# Altium project Infinit8I__.PrjPcb
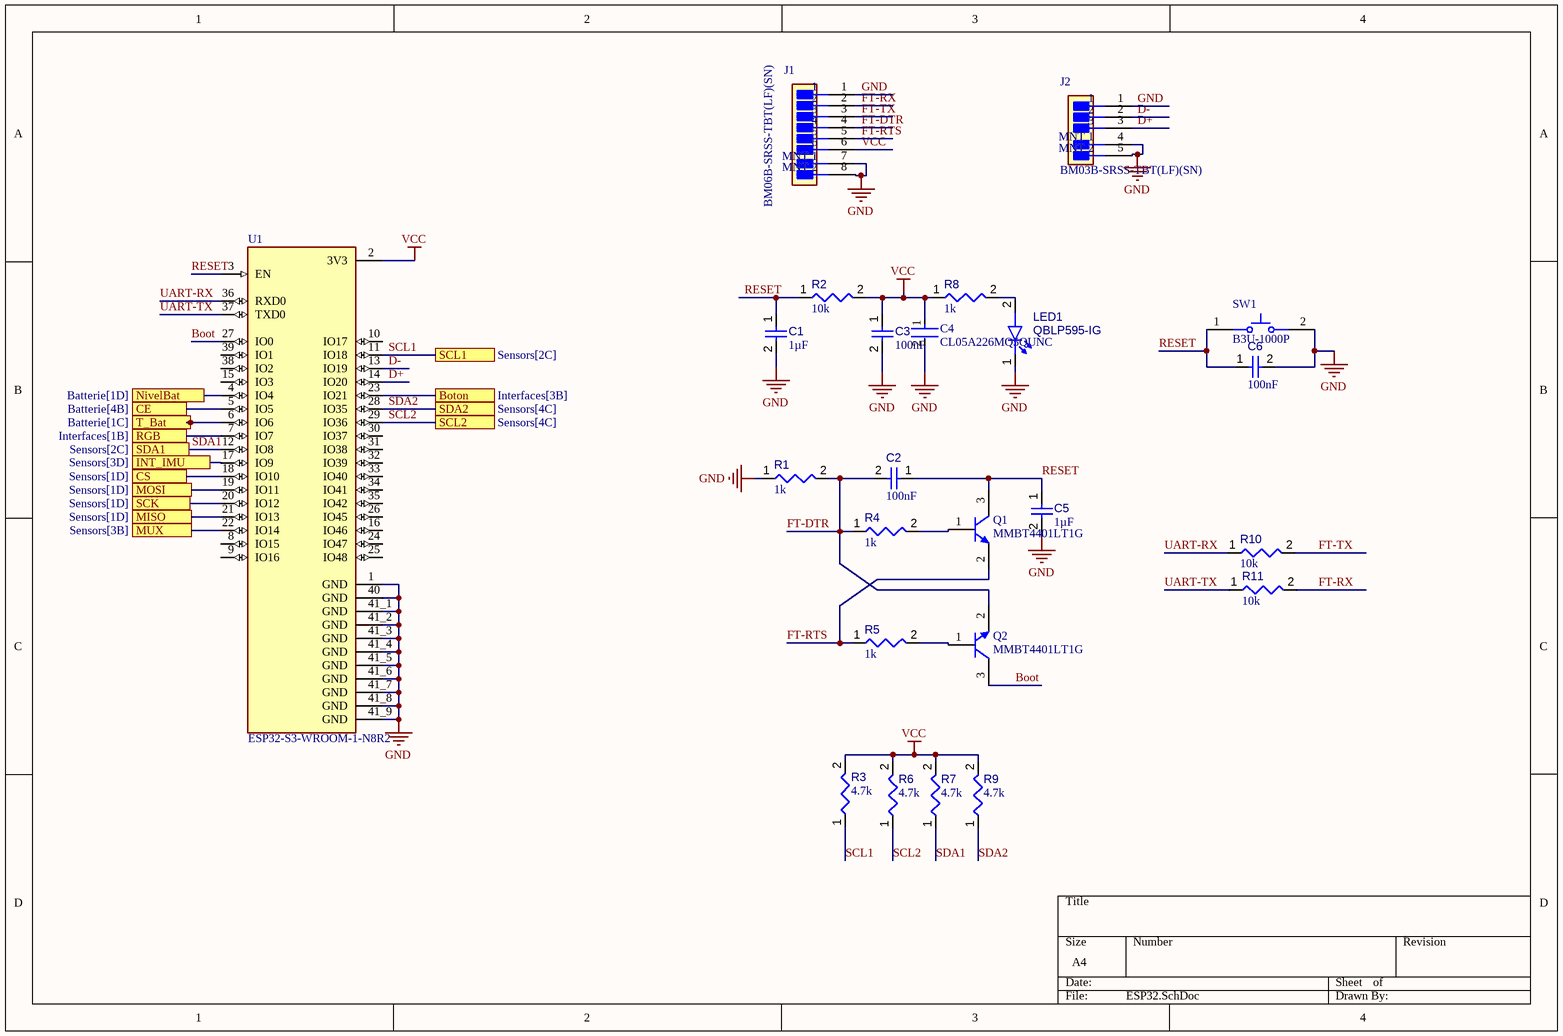
[diagram p0: ESP32.SchDoc]
4 sheets, 83 parts. Net scope: flat (ports and power ports of the same name join across sheets).
Board file: Infinit8I.PcbDoc
Sheets:
  ESP32.SchDoc
  Sensors.SchDoc
  Interfaces.SchDoc
  Batterie.SchDoc

## Sheet ESP32.SchDoc
size A4; SheetNumber: 1; SheetTotal: 4

### Parts
C1  value 1µF  [CAPC1005X55X25LL05T10]  (hidden comment: Capacitor 1 uF +/- 10% 6.3 V 0402)
C2  value 100nF  [CAPC1005X56X25LL10T15]  (hidden comment: Capacitor 0.1 uF +/- 5% 16 V 0402)
C3  value 100nF  [CAPC1005X56X25LL10T15]  (hidden comment: Capacitor 0.1 uF +/- 5% 16 V 0402)
C4  CL05A226MQ5QUNC  [FP-CL746-IPC_C]
C5  value 1µF  [CAPC1005X55X25LL05T10]  (hidden comment: Capacitor 1 uF +/- 10% 6.3 V 0402)
C6  value 100nF  [CAPC1005X56X25LL10T15]  (hidden comment: Capacitor 0.1 uF +/- 5% 16 V 0402)
J1  BM06B-SRSS-TBT(LF)(SN)  [FP-BM06B-SRSS-TBT_LF_SN-MFG]
J2  BM03B-SRSS-TBT(LF)(SN)  [FP-BM03B-SRSS-TBT_LF_SN-MFG]
LED1  QBLP595-IG  [QTB-QBLP595_V]
Q1  MMBT4401LT1G  [ONSC-SOT-23-3-318-08_V]
Q2  MMBT4401LT1G  [ONSC-SOT-23-3-318-08_V]
R1  value 1k  [RESC0402(1005)_L]  (hidden comment: Resistor 1K +/-5 % 0402 63 mW)
R2  value 10k  [RESC0402(1005)_L]  (hidden comment: Resistor 10K  +/-1 % 0402 63 mW)
R3  value 4.7k  [RESC1005X40X25ML05T05]  (hidden comment: Resistor 4k7 +/-1% 0402 100 mW)
R4  value 1k  [RESC0402(1005)_L]  (hidden comment: Resistor 1K +/-5 % 0402 63 mW)
R5  value 1k  [RESC0402(1005)_L]  (hidden comment: Resistor 1K +/-5 % 0402 63 mW)
R6  value 4.7k  [RESC1005X40X25ML05T05]  (hidden comment: Resistor 4k7 +/-1% 0402 100 mW)
R7  value 4.7k  [RESC1005X40X25ML05T05]  (hidden comment: Resistor 4k7 +/-1% 0402 100 mW)
R8  value 1k  [RESC0402(1005)_L]  (hidden comment: Resistor 1K +/-5 % 0402 63 mW)
R9  value 4.7k  [RESC1005X40X25ML05T05]  (hidden comment: Resistor 4k7 +/-1% 0402 100 mW)
R10  value 10k  [RESC0402(1005)_L]  (hidden comment: Resistor 10K  +/-1 % 0402 63 mW)
R11  value 10k  [RESC0402(1005)_L]  (hidden comment: Resistor 10K  +/-1 % 0402 63 mW)
SW1  B3U-1000P  [OMRON-B3U-1000_V]
U1  ESP32-S3-WROOM-1-N8R2  [XCVR_ESP32-S3-WROOM-1-N8R2]

### Ports
Boton (see Interfaces[3B]), CE (see Batterie[4B]), CS (see Sensors[1D]), INT_IMU (see Sensors[3D]), MISO (see Sensors[1D]), MOSI (see Sensors[1D]), MUX (see Sensors[3B]), NivelBat (see Batterie[1D]), RGB (see Interfaces[1B]), SCK (see Sensors[1D]), SCL1 (see Sensors[2C]), SCL2 (see Sensors[4C]), SDA1 (see Sensors[2C]), SDA2 (see Sensors[4C]), T_Bat (see Batterie[1C])

### Nets
GND: C1.2 C3.2 C4.2 C5.2 C6.2 J1.1 J1.7(MNT_1) J1.8(MNT_2) J2.1 J2.4(MNT_1) J2.5(MNT_2) LED1.1(K) R1.1 SW1.2 U1.1(GND) U1.40(GND) U1.41_1(GND) U1.41_2(GND) U1.41_3(GND) U1.41_4(GND) U1.41_5(GND) U1.41_6(GND) U1.41_7(GND) U1.41_8(GND) U1.41_9(GND)
VCC: C3.1 C4.1 J1.6 R2.2 R3.2 R6.2 R7.2 R8.1 R9.2 U1.2(3V3)
Boot: Q2.3(C) U1.27(IO0)
D+: J2.3 U1.14(IO20)
D-: J2.2 U1.13(IO19)
FT-DTR: C2.2 J1.4 Q2.2(E) R1.2 R4.1
FT-RTS: J1.5 Q1.2(E) R5.1
FT-RX: J1.2 R11.2
FT-TX: J1.3 R10.2
MUX: U1.22(IO14) ; port MUX
RESET: C1.1 C2.1 C5.1 C6.1 Q1.3(C) R2.1 SW1.1 U1.3(EN)
SCL1: R3.1 U1.11(IO18) ; port SCL1
SCL2: R6.1 U1.29(IO36) ; port SCL2
SDA1: R7.1 U1.12(IO8) ; port SDA1
SDA2: R9.1 U1.28(IO35) ; port SDA2
T_Bat: U1.6(IO6) ; port T_Bat
UART-RX: R10.1 U1.36(RXD0)
UART-TX: R11.1 U1.37(TXD0)
NetLED1_2: LED1.2(A) R8.2
NetQ1_1: Q1.1(B) R4.2
NetQ2_1: Q2.1(B) R5.2
NetR21_2: U1.23(IO21) ; port Boton
NetR24_2: U1.4(IO4) ; port NivelBat
NetU1_5: U1.5(IO5) ; port CE
NetU1_7: U1.7(IO7) ; port RGB
NetU1_17: U1.17(IO9) ; port INT_IMU
NetU1_18: U1.18(IO10) ; port CS
NetU1_19: U1.19(IO11) ; port MOSI
NetU1_20: U1.20(IO12) ; port SCK
NetU1_21: U1.21(IO13) ; port MISO

Not connected (* = marked no-connect by the designer): U1 8(IO15) 9(IO16) 10(IO17) 15(IO3) 16(IO46) 24(IO47) 25(IO48) 26(IO45) 30(IO37) 31(IO38) 32(IO39) 33(IO40) 34(IO41) 35(IO42) 38(IO2) 39(IO1)

### Library data of the parts
C1 C5 = CMP-001-00008-6: Chip Capacitor, 1 uF, +/- 10%, 6.3 V, 0402 (1005 Metric); Capacitor Type: Ceramic; Voltage Rating: 6.3V; Max Operating Temperature: 85°C; Mounting Technology: SM; Tolerance: 10%; Case/Package: 0402; RoHS Compliant: True; Min Operating Temperature: -55°C; Pins: 2
C2 C3 C6 = CMP-001-00001-6: Chip Capacitor, 0.1 uF, +/- 5%, 16 V, 0402 (1005 Metric); Capacitor Type: Ceramic; Voltage Rating: 16V; Max Operating Temperature: 125°C; Min Operating Temperature: -55°C; Case/Package: 0402; Mounting Technology: SM; Pins: 2; Tolerance: 5%; RoHS Compliant: True
C4 = CMP-13271-000286-1: Cap Ceramic 22uF 6.3V X5R ±20% SMD 0402 +85°C Paper T/R; Case Code (Imperial): 0402; Tolerance: 20%; Width: 0.02inch; Packaging: Tape and Reel; Case/Package: 0402; Min Operating Temperature: -55°C; Max Operating Temperature: 85°C; Voltage Rating: 6.3V; Capacitance: 22uF; Thickness: 0.022inch; Mount: Surface Mount; Length: 0.039inch; Case Code (Metric): 1005
J1 = CMP-00030-00001-2: Conn Shrouded Header HDR 6 POS 1mm Solder ST SMD Embossed T/R
J2 = CMP-00030-00002-2: Conn Shrouded Header (4 Sides) HDR 3 POS 1mm Solder ST Top Entry SMD T/R
LED1 = CMP-007-00041-3: Chip LED 0402, Green, 0.02 A, 3.1 to 3.7 V, -40 to 80 degC, 2-Pin SMD, RoHS, Tape and Reel; Case/Package: 0402; Colour: Green; Mounting Technology: SMT; Pins: 2; RoHS Compliant: Yes
Q1 Q2 = CMP-1048-00545-1: Switching Transistor, NPN Silicon, 3-Pin SOT-23, Pb-Free, Tape and Reel; Manufacturer: On Semiconductor; IC Continuous (A): 0.6; fT Min (MHz): 250; Mounting Technology: Surface Mount; ComponentLink2URL: http://www.onsemi.cn/pub_link/Collateral/MMBT4401LT1-D.PDF; PackageDescription: 3-Pin Small Outline Transistor, Body 2.92 x 1.3 mm, Pitch 0.95 mm; ComponentLink3Description: Package Specification; Polarity: NPN; PackageReference: SOT-23-3-318-08; PackageVersion: Rev. AP, 11/2009; ComponentLink1URL: http://www.onsemi.com/; ComponentLink3URL: http://www.onsemi.cn/pub_link/Collateral/318-08.PDF; Packing: Tape and Reel; ComponentLink1Description: Manufacturer URL; PartNumber: MMBT4401LT1G; RoHS: TRUE; ComponentLink2Description: Datasheet; DatasheetVersion: Rev. 10
R1 R4 R5 R8 = CMP-009-00157-3: Chip Resistor, 1 kOhms, +/-5 %, 63 mW, -55 to 155 degC, 0402; Tolerance: 5%; Power: 63mW; Case/Package: 0402; Pins: 2; Min Operating Temperature: -55°C; Max Operating Temperature: 155°C
R2 R10 R11 = CMP-009-00149-3: Chip Resistor, 10 kOhms, +/-1 %, 63 mW, -55 to 125 degC, 0402; Power: 63mW; Tolerance: 1%; Min Operating Temperature: -55°C; Case/Package: 0402; Max Operating Temperature: 155°C; Pins: 2
R3 R6 R7 R9 = CMP-009-00030-5: Chip Resistor, 4.7 KOhm, +/- 1%, 0.1 W, -55 to 155 degC, 0402 (1005 Metric); Power: 100mW; Voltage Rating: 50V; Mounting Technology: SM; RoHS Compliant: True; Tolerance: 1%; Min Operating Temperature: -55°C; Max Operating Temperature: 155°C; Case/Package: 0402; Pins: 2
SW1 = CMP-011-00000-2: Tactile Switch, SPST-NO, 0.05 A, 12 V, -25 to 70 degC, 2-Pin SMD, RoHS, Tape and Reel; Manufacturer: Omron Electronic Components; IP Rating: IP40; Current Rating: 50mA; Max Contact Resistance: 100mohm; Operating Force: 153gf; Throw Configuration: SPST; Resistance: 0.1Ohm; Max Voltage Rating (DC): 12V; Contact Material: Silver; Max Current Rating: 50mA; Datasheet URL: http://www.omron.com/ecb/products/pdf/en-b3u.pdf; Mounting Technology: SM; Case/Package: B3U-1000; Packaging: TapeandReel; Package Reference: B3U-1000; Manufacturer URL: http://www.omron.com/; Datasheet Version: Jan-15; RoHS Compliant: True; Max Operating Temperature: 70°C; Contact Current Rating: 50mA; Package Quantity: 3500; Package Description: 2-Pin Surface Mount Device, Body 3 x 2.5 mm; Voltage Rating (DC): 12V; Min Operating Temperature: -25°C; Voltage Rating: 12V
U1 = CMP-003-000000-1: WiFi 802.11a/b/g/n, Bluetooth v5.0 Transceiver Module 2.4GHz Antenna Not Included -; MF: Espressif Systems; Component Type: Standard; Package: - Espressif Systems; SnapEDA_Link: https://www.snapeda.com/parts/ESP32-S3-WROOM-1-N8R2/Espressif+Systems/view-part/?ref=snap; Availability: In Stock; Purchase-URL: https://pricing.snapeda.com/search?q=ESP32-S3-WROOM-1-N8R2&ref=eda; Design Item ID: ESP32-S3-WROOM-1-N8R2; Price: None; Check_prices: https://www.snapeda.com/parts/ESP32-S3-WROOM-1-N8R2/Espressif+Systems/view-part/?ref=eda; Value: *; Source: ESP32-S3-WROOM-1-N8R2.SchLib; MP: ESP32-S3-WROOM-1-N8R2; Pin Count: 49

## Sheet Sensors.SchDoc
size A4; SheetNumber: 2; SheetTotal: 4
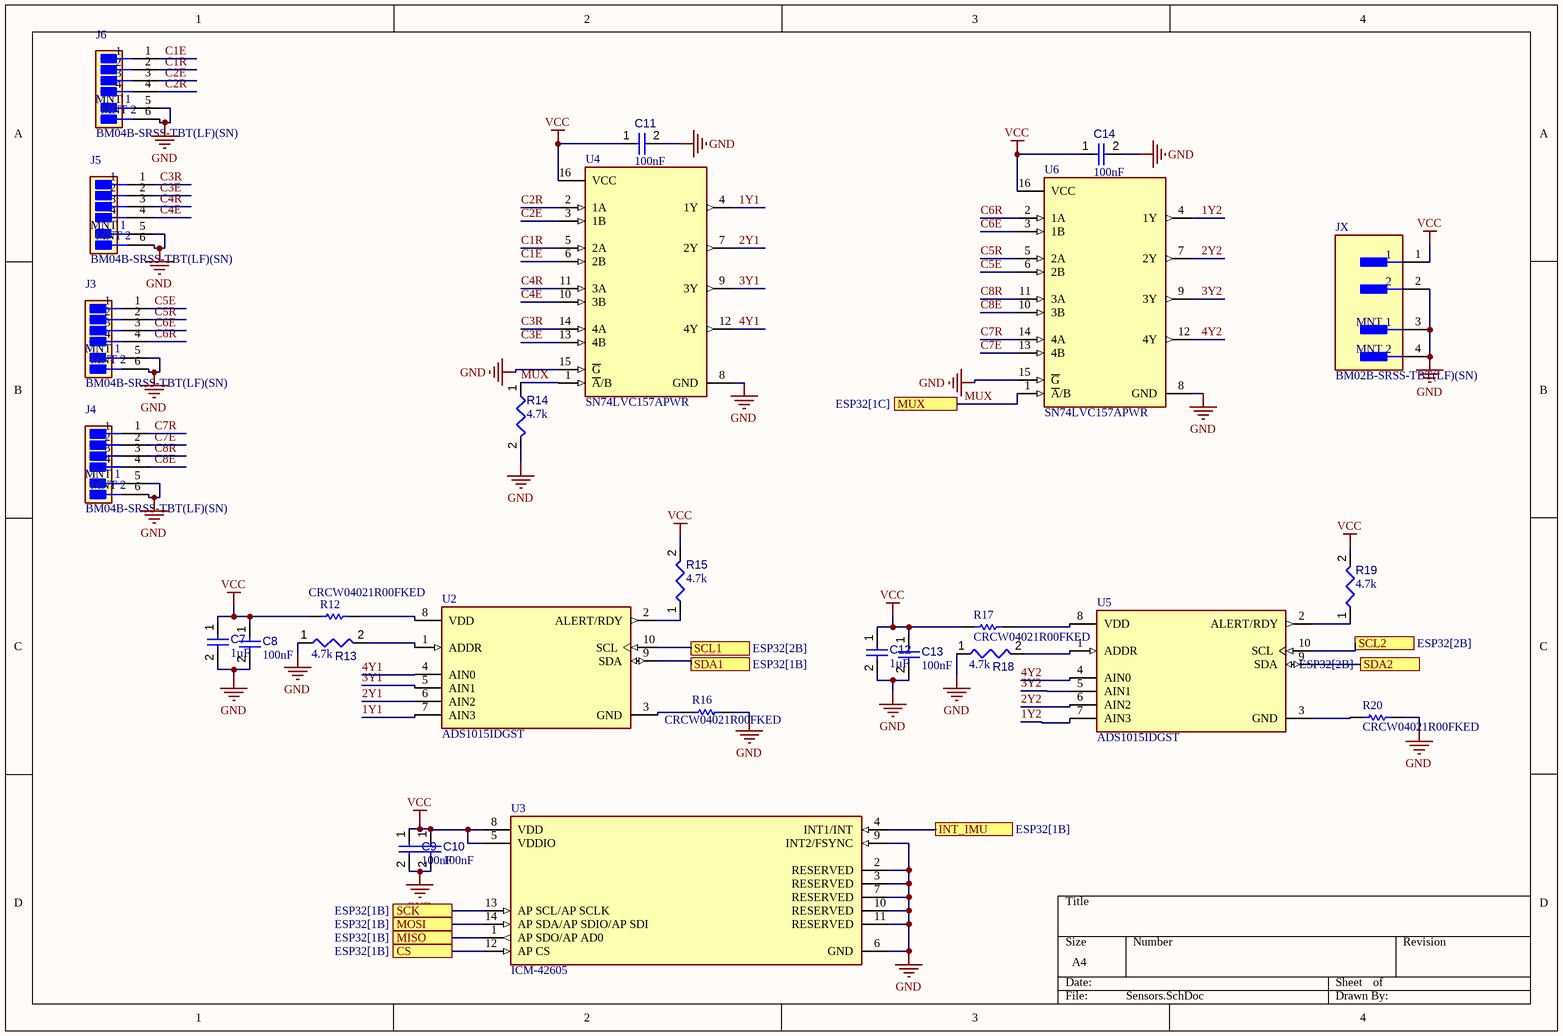
[diagram p1: Sensors.SchDoc]

### Parts
C7  value 1µF  [CAPC1005X55X25LL05T10]  (hidden comment: Capacitor 1 uF +/- 10% 6.3 V 0402)
C8  value 100nF  [CAPC1005X56X25LL10T15]  (hidden comment: Capacitor 0.1 uF +/- 5% 16 V 0402)
C9  value 100nF  [CAPC1005X56X25LL10T15]  (hidden comment: Capacitor 0.1 uF +/- 5% 16 V 0402)
C10  value 100nF  [CAPC1005X56X25LL10T15]  (hidden comment: Capacitor 0.1 uF +/- 5% 16 V 0402)
C11  value 100nF  [CAPC1005X56X25LL10T15]  (hidden comment: Capacitor 0.1 uF +/- 5% 16 V 0402)
C12  value 1µF  [CAPC1005X55X25LL05T10]  (hidden comment: Capacitor 1 uF +/- 10% 6.3 V 0402)
C13  value 100nF  [CAPC1005X56X25LL10T15]  (hidden comment: Capacitor 0.1 uF +/- 5% 16 V 0402)
C14  value 100nF  [CAPC1005X56X25LL10T15]  (hidden comment: Capacitor 0.1 uF +/- 5% 16 V 0402)
J3  BM04B-SRSS-TBT(LF)(SN)  [FP-BM04B-SRSS-TBT_LF_SN-MFG]
J4  BM04B-SRSS-TBT(LF)(SN)  [FP-BM04B-SRSS-TBT_LF_SN-MFG]
J5  BM04B-SRSS-TBT(LF)(SN)  [FP-BM04B-SRSS-TBT_LF_SN-MFG]
J6  BM04B-SRSS-TBT(LF)(SN)  [FP-BM04B-SRSS-TBT_LF_SN-MFG]
JX  BM02B-SRSS-TBT(LF)(SN)  [FP-BM02B-SRSS-TBT_LF_SN-MFG]
R12  CRCW04021R00FKED  [RESC1005X40X25ML05T05]
R13  value 4.7k  [RESC1005X40X25ML05T05]  (hidden comment: Resistor 4k7 +/-1% 0402 100 mW)
R14  value 4.7k  [RESC1005X40X25ML05T05]  (hidden comment: Resistor 4k7 +/-1% 0402 100 mW)
R15  value 4.7k  [RESC1005X40X25ML05T05]  (hidden comment: Resistor 4k7 +/-1% 0402 100 mW)
R16  CRCW04021R00FKED  [RESC1005X40X25ML05T05]
R17  CRCW04021R00FKED  [RESC1005X40X25ML05T05]
R18  value 4.7k  [RESC1005X40X25ML05T05]  (hidden comment: Resistor 4k7 +/-1% 0402 100 mW)
R19  value 4.7k  [RESC1005X40X25ML05T05]  (hidden comment: Resistor 4k7 +/-1% 0402 100 mW)
R20  CRCW04021R00FKED  [RESC1005X40X25ML05T05]
U2  ADS1015IDGST  [FP-DGS0010A-MFG]
U3  ICM-42605  [FP-ICM-42605-MFG]
U4  SN74LVC157APWR  [FP-PW0016A-IPC_B]
U5  ADS1015IDGST  [FP-DGS0010A-MFG]
U6  SN74LVC157APWR  [FP-PW0016A-IPC_B]

### Ports
CS (see ESP32[1B]), INT_IMU (see ESP32[1B]), MISO (see ESP32[1B]), MOSI (see ESP32[1B]), MUX (see ESP32[1C]), SCK (see ESP32[1B]), SCL1 (see ESP32[2B]), SCL2 (see ESP32[2B]), SDA1 (see ESP32[1B]), SDA2 (see ESP32[2B])

### Nets
GND: C7.2 C8.2 C9.2 C10.2 C11.2 C12.2 C13.2 C14.2 J3.5(MNT_1) J3.6(MNT_2) J4.5(MNT_1) J4.6(MNT_2) J5.5(MNT_1) J5.6(MNT_2) J6.5(MNT_1) J6.6(MNT_2) JX.2 JX.3(MNT_1) JX.4(MNT_2) R13.1 R14.2 R16.2 R18.1 R20.2 U3.2(RESERVED) U3.3(RESERVED) U3.6(GND) U3.7(RESERVED) U3.9(INT2/FSYNC) U3.10(RESERVED) U3.11(RESERVED) U4.8(GND) U4.15(~{G}) U6.8(GND) U6.15(~{G})
VCC: C7.1 C8.1 C9.1 C10.1 C11.1 C12.1 C13.1 C14.1 JX.1 R12.1 R15.2 R17.1 R19.2 U3.5(VDDIO) U3.8(VDD) U4.16(VCC) U6.16(VCC)
1Y1: U2.7(AIN3) U4.4(1Y)
1Y2: U5.7(AIN3) U6.4(1Y)
2Y1: U2.6(AIN2) U4.7(2Y)
2Y2: U5.6(AIN2) U6.7(2Y)
3Y1: U2.5(AIN1) U4.9(3Y)
3Y2: U5.5(AIN1) U6.9(3Y)
4Y1: U2.4(AIN0) U4.12(4Y)
4Y2: U5.4(AIN0) U6.12(4Y)
C1E: J6.1 U4.6(2B)
C1R: J6.2 U4.5(2A)
C2E: J6.3 U4.3(1B)
C2R: J6.4 U4.2(1A)
C3E: J5.2 U4.13(4B)
C3R: J5.1 U4.14(4A)
C4E: J5.4 U4.10(3B)
C4R: J5.3 U4.11(3A)
C5E: J3.1 U6.6(2B)
C5R: J3.2 U6.5(2A)
C6E: J3.3 U6.3(1B)
C6R: J3.4 U6.2(1A)
C7E: J4.2 U6.13(4B)
C7R: J4.1 U6.14(4A)
C8E: J4.4 U6.10(3B)
C8R: J4.3 U6.11(3A)
MUX: R14.1 U4.1(~{A}/B) U6.1(~{A}/B) ; port MUX
SCL1: U2.10(SCL) ; port SCL1
SCL2: U5.10(SCL) ; port SCL2
SDA1: U2.9(SDA) ; port SDA1
SDA2: U5.9(SDA) ; port SDA2
NetR12_2: R12.2 U2.8(VDD)
NetR13_2: R13.2 U2.1(ADDR)
NetR15_1: R15.1 U2.2(ALERT/RDY)
NetR16_1: R16.1 U2.3(GND)
NetR17_2: R17.2 U5.8(VDD)
NetR18_2: R18.2 U5.1(ADDR)
NetR19_1: R19.1 U5.2(ALERT/RDY)
NetR20_1: R20.1 U5.3(GND)
NetU1_17: U3.4(INT1/INT) ; port INT_IMU
NetU1_18: U3.12(AP_CS) ; port CS
NetU1_19: U3.14(AP_SDA/AP_SDIO/AP_SDI) ; port MOSI
NetU1_20: U3.13(AP_SCL/AP_SCLK) ; port SCK
NetU1_21: U3.1(AP_SDO/AP_AD0) ; port MISO

### Library data of the parts
C7 C12 = CMP-001-00008-6: as C1 on sheet ESP32; Max Operating Temperature: 85°C; Mounting Technology: SM; Tolerance: 10%; Case/Package: 0402; RoHS Compliant: True; Min Operating Temperature: -55°C; Pins: 2
C8-C11 C13 C14 = CMP-001-00001-6: as C2 on sheet ESP32; Max Operating Temperature: 125°C; Min Operating Temperature: -55°C; Case/Package: 0402; Mounting Technology: SM; Pins: 2; Tolerance: 5%; RoHS Compliant: True
J3-J6 = CMP-00030-00003-2: 1.0mm Pitch, Ultra-Compact, Low Profile Design, Interchangeable Shrouded Header
JX = CMP-17439-000179-1: CONN WIRE HDR 2POS 1MM STSMD; Mated Stacking Heights: 4.9mm; Max Current Rating: 1A; Pitch: 0.039inch; Contact Resistance: 20mR; Max Voltage Rating (DC): 50V; Connector Type: Header; Number of Positions: 2; Insulation Material: Nylon; Termination: Solder; Contact Plating: Tin; Mount: Surface Mount; Package Quantity: 1500; Housing Color: Natural; Orientation: Straight; Max Operating Temperature: 85°C; Min Operating Temperature: -25°C; Length: 4mm; Lead Free: Lead Free; Contact Type: Male Pin; Depth: 3.6mm; Contact Material: Copper Alloy; Packaging: Tape and Reel; Number of Rows: 1; Contact Shape: Square; Flammability Rating: UL94 V-0; Voltage Rating: 50V; Color: Natural; Contact Finish - Mating: TIN; Fastening Type: Pull; Insulation Color: Natural; Series: SR; Max Voltage Rating (AC): 50V; Housing Material: Polyamide
R12 R16 R17 R20 = CMP-2002-08342-1: Manufacturer: Vishay Dale; Part Number: CRCW04021R00FKED
R13-R15 R18 R19 = CMP-009-00030-5: as R3 on sheet ESP32; Mounting Technology: SM; RoHS Compliant: True; Tolerance: 1%; Min Operating Temperature: -55°C; Max Operating Temperature: 155°C; Case/Package: 0402; Pins: 2
U2 U5 = CMP-0003-00377-3: IC ADC 12BIT SIGMA-DELTA 10VSSOP; Supply Type: Single; Number of Converters: 1; Number of Bits: 12; Number of Inputs: 4; Sampling Rate: 3.3KS/s; Conversion Rate: 3300S/s; Min Supply Voltage: 2V; Interface: I2C; Operating Supply Voltage: 3.3V; Polarity: Bipolar; Nominal Supply Current: 150uA; Integral Nonlinearity (INL): 0.5LSB; Max Power Dissipation: 900uW; Max Supply Voltage (DC): 5.5V; Resolution: 12b; Width: 3mm; Min Operating Temperature: -40°C; Contact Plating: Gold; Number of A/D Converters: 1; Max Operating Temperature: 125°C; Height: 1.02mm; Case/Package: VSSOP; Package Quantity: 250; Number of Elements: 1; Lead Free: Lead Free; Number of Pins: 10; Radiation Hardening: No; Termination: SMD/SMT; Length: 3mm; Min Supply Voltage (DC): 2V; Power Dissipation: 900uW; Number of Channels: 4; Max Supply Voltage: 5.5V; REACH SVHC: No SVHC; Packaging: Tape and Reel
U3 = ICM-42605-1: Open-drain, CMOS, 14 Pin
U4 U6 = CMP-031-00008-1: Multiplexer, LVC/LCX/Z Series, 4-Func, 2 Line Input, 1 Line Output, True Output, CMOS, PDSO16; Min Supply Voltage: 1.65V; Max Supply Voltage: 3.6V; Min Operating Temperature: -40°C; RoHS Compliant: Yes; Pins: 16; Max Operating Temperature: 85°C; Case/Package: TSSOP

## Sheet Interfaces.SchDoc
size A4; SheetNumber: 3; SheetTotal: 4
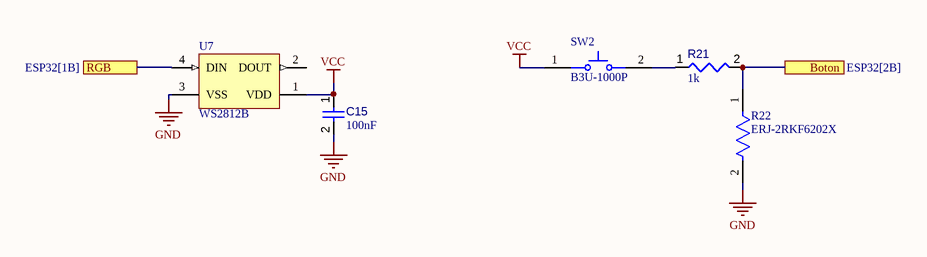
[diagram p2: Interfaces.SchDoc]

### Parts
C15  value 100nF  [CAPC1005X56X25LL10T15]  (hidden comment: Capacitor 0.1 uF +/- 5% 16 V 0402)
R21  value 1k  [RESC0402(1005)_L]  (hidden comment: Resistor 1K +/-5 % 0402 63 mW)
R22  ERJ-2RKF6202X  [FP-ERJ2RK-MFG]
SW2  B3U-1000P  [OMRON-B3U-1000_V]
U7  WS2812B  [ADAI-WS2812B_V]

### Ports
Boton (see ESP32[2B]), RGB (see ESP32[1B])

### Nets
GND: C15.2 R22.2 U7.3(VSS)
VCC: C15.1 SW2.1 U7.1(VDD)
NetR21_1: R21.1 SW2.2
NetR21_2: R21.2 R22.1 ; port Boton
NetU1_7: U7.4(DIN) ; port RGB

Not connected (* = marked no-connect by the designer): U7 2(DOUT)

### Library data of the parts
C15 = CMP-001-00001-6: as C2 on sheet ESP32; Max Operating Temperature: 125°C; Min Operating Temperature: -55°C; Case/Package: 0402; Mounting Technology: SM; Pins: 2; Tolerance: 5%; RoHS Compliant: True
R21 = CMP-009-00157-3: as R1 on sheet ESP32; Case/Package: 0402; Pins: 2; Min Operating Temperature: -55°C; Max Operating Temperature: 155°C
R22 = CMP-2002-01165-2: NexarPartId: 55404988; Voltage Rating (DC): 50V; Power Rating: 100mW; Temperature Coefficient: 100ppm/°C; Resistance: 62kΩ; Tolerance: 1%; Min Operating Temperature: -55°C; RoHS: Compliant; Case/Package: 0402; Composition: Thick Film; Lead Free: Lead Free; Packaging: Cut Tape; Mount: Surface Mount; Contact Plating: Tin; Depth: 500µm; Schedule B: 8533210045, 8533210045; Max Operating Temperature: 155°C; Termination: SMD/SMT; Case Code (Imperial): 0402; Features: Automotive AEC-Q200; Max Power Dissipation: 100mW; Voltage Rating: 50V; Military Standard: Not; Number of Terminations: 2; Lifecycle Status: Production; REACH SVHC: No SVHC; Length: 1mm; Width: 508µm; Case Code (Metric): 1005; Height: 350µm
SW2 = CMP-011-00000-2: as SW1 on sheet ESP32; Contact Material: Silver; Max Current Rating: 50mA; Datasheet URL: http://www.omron.com/ecb/products/pdf/en-b3u.pdf; Mounting Technology: SM; Case/Package: B3U-1000; Packaging: TapeandReel; Package Reference: B3U-1000; Manufacturer URL: http://www.omron.com/; Datasheet Version: Jan-15; RoHS Compliant: True; Max Operating Temperature: 70°C; Contact Current Rating: 50mA; Package Quantity: 3500; Package Description: 2-Pin Surface Mount Device, Body 3 x 2.5 mm; Voltage Rating (DC): 12V; Min Operating Temperature: -25°C; Voltage Rating: 12V
U7 = CMP-007-00035-2: Intelligent Control LED Integrated Light Source, 3.5 to 5.3 V, -25 to 80 degC, 4-Pin SMD, RoHS, Bulk; Manufacturer: Adafruit Industries; Datasheet URL: https://cdn-shop.adafruit.com/datasheets/WS2812B.pdf; Manufacturer URL: https://www.adafruit.com/; Datasheet Version: May-13; Case/Package: WS2812B; Mounting Technology: SM; RoHS Compliant: False; Package Description: 4-Pin Surface Mount Device, Body 5 x 5 mm, Pitch 3.3 mm; Package Reference: WS2812B

## Sheet Batterie.SchDoc
size A4; SheetNumber: 4; SheetTotal: 4
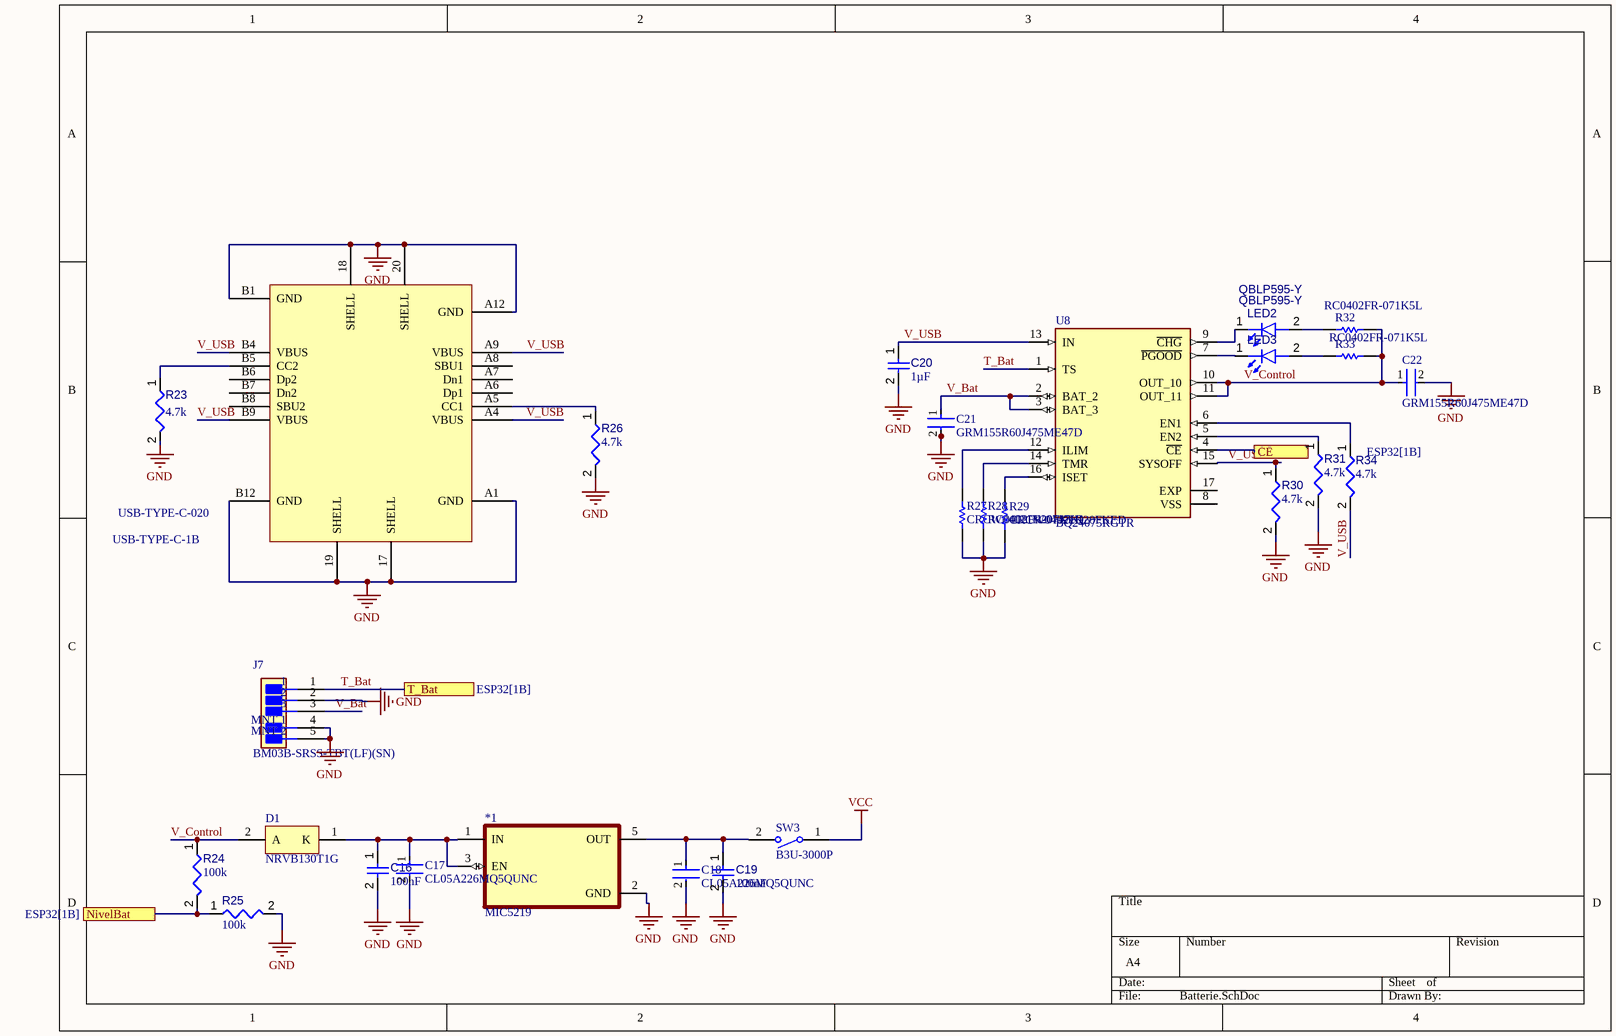
[diagram p3: Batterie.SchDoc]

### Parts
*1  MIC5219  [SOT95P280X145-5N]
C16  value 100nF  [CAPC1005X56X25LL10T15]  (hidden comment: Capacitor 0.1 uF +/- 5% 16 V 0402)
C17  CL05A226MQ5QUNC  [FP-CL746-IPC_C]
C18  CL05A226MQ5QUNC  [FP-CL746-IPC_C]
C19  value 100nF  [CAPC1005X56X25LL10T15]  (hidden comment: Capacitor 0.1 uF +/- 5% 16 V 0402)
C20  value 1µF  [CAPC1005X55X25LL05T10]  (hidden comment: Capacitor 1 uF +/- 10% 6.3 V 0402)
C21  GRM155R60J475ME47D  [FP-GRM155-0_1-IPC_B]
C22  GRM155R60J475ME47D  [FP-GRM155-0_1-IPC_B]
D1  NRVB130T1G  [ONSC-SOD-123-2-425-04_V]
J7  BM03B-SRSS-TBT(LF)(SN)  [FP-BM03B-SRSS-TBT_LF_SN-MFG]
LED2  QBLP595-Y  [QTB-QBLP595_V]
LED3  QBLP595-Y  [QTB-QBLP595_V]
R23  value 4.7k  [RESC1005X40X25ML05T05]  (hidden comment: Resistor 4k7 +/-1% 0402 100 mW)
R24  value 100k  [RESC1005X40X25ML05T05]  (hidden comment: Resistor 1k +/-1% 0402 63 mW)
R25  value 100k  [RESC1005X40X25ML05T05]  (hidden comment: Resistor 1k +/-1% 0402 63 mW)
R26  value 4.7k  [RESC1005X40X25ML05T05]  (hidden comment: Resistor 4k7 +/-1% 0402 100 mW)
R27  CRCW04021K20FKED  [RESC1005X40X25NL05T05]
R28  RC0402FR-0747KL  [RESC1005X40X25ML05T10]
R29  CRCW04021K20FKED  [RESC1005X40X25NL05T05]
R30  value 4.7k  [RESC1005X40X25ML05T05]  (hidden comment: Resistor 4k7 +/-1% 0402 100 mW)
R31  value 4.7k  [RESC1005X40X25ML05T05]  (hidden comment: Resistor 4k7 +/-1% 0402 100 mW)
R32  RC0402FR-071K5L  [RESC1005X40X25ML05T10]
R33  RC0402FR-071K5L  [RESC1005X40X25ML05T10]
R34  value 4.7k  [RESC1005X40X25ML05T05]  (hidden comment: Resistor 4k7 +/-1% 0402 100 mW)
SW3  B3U-3000P  [OMRON-B3U-3000P_V]
U8  BQ24075RGTR  [QFN50P300X300X100-17N]
USB-TYPE-C-1  USB-TYPE-C-020  [PCBComponent_1]  (part B of 2)

### Ports
CE (see ESP32[1B]), NivelBat (see ESP32[1B]), T_Bat (see ESP32[1B])

### Nets
GND: *1.2(GND) C16.2 C17.2 C18.2 C19.2 C20.2 C21.2 C22.2 J7.2 J7.4(MNT_1) J7.5(MNT_2) R23.2 R25.2 R26.2 R27.1 R28.2 R29.1 R30.2 R31.2 USB-TYPE-C-1.17(SHELL) USB-TYPE-C-1.18(SHELL) USB-TYPE-C-1.19(SHELL) USB-TYPE-C-1.20(SHELL) USB-TYPE-C-1.A1(GND) USB-TYPE-C-1.A12(GND) USB-TYPE-C-1.B1(GND) USB-TYPE-C-1.B12(GND)
VCC: SW3.1
T_Bat: J7.1 U8.1(TS) ; port T_Bat
V_Bat: C21.1 J7.3 U8.2(BAT_2) U8.3(BAT_3)
V_Control: C22.1 D1.2(A) R24.1 R32.2 R33.2 U8.10(OUT_10) U8.11(OUT_11)
V_USB: C20.1 R30.1 R34.2 U8.13(IN) U8.15(SYSOFF) USB-TYPE-C-1.A4(VBUS) USB-TYPE-C-1.A9(VBUS) USB-TYPE-C-1.B4(VBUS) USB-TYPE-C-1.B9(VBUS)
Net*1_1: *1.1(IN) *1.3(EN) C16.1 C17.1 D1.1(K)
Net*1_5: *1.5(OUT) C18.1 C19.1 SW3.2
NetLED2_1: LED2.1(K) U8.9(~{CHG})
NetLED2_2: LED2.2(A) R32.1
NetLED3_1: LED3.1(K) U8.7(~{PGOOD})
NetLED3_2: LED3.2(A) R33.1
NetR23_1: R23.1 USB-TYPE-C-1.B5(CC2)
NetR24_2: R24.2 R25.1 ; port NivelBat
NetR26_1: R26.1 USB-TYPE-C-1.A5(CC1)
NetR27_2: R27.2 U8.12(ILIM)
NetR28_1: R28.1 U8.14(TMR)
NetR29_2: R29.2 U8.16(ISET)
NetR31_1: R31.1 U8.5(EN2)
NetR34_1: R34.1 U8.6(EN1)
NetU1_5: U8.4(~{CE}) ; port CE

Not connected (* = marked no-connect by the designer): U8 8(VSS) 17(EXP); USB-TYPE-C-1 A6(Dp1) A7(Dn1) A8(SBU1) B6(Dp2) B7(Dn2) B8(SBU2)

### Library data of the parts
*1 = CMP-018-000000-2: Fixed Positive LDO Regulator, 3.3V, 0.6V Dropout, BIPolar, PDSO5; Output Current1-Max: 500mA; Package Equivalence Code: TSOP5/6,.11,37; Regulator Type: FIXED POSITIVE SINGLE OUTPUT LDO REGULATOR; Output Voltage1-Max: 3.366V; Output Voltage1-Min: 3.234V; Package Body Material: Plastic; Input Voltage Absolute-Max: 20V; Dropout Voltage1-Max: 600mV; Time @ Peak Reflow Temperature-Max (s): 30s; Channels: 1; Line Regulation-Max: 0.02541%; Qualification Status: Not Qualified; Max Supply Voltage: 12V; Voltage Tolerance-Max: 2%; Min Input Voltage: 2.5V; Load Regulation-Max: 0.0231%; Technology: BIPOLAR; Operating Temperature, TJ-Max: 125°C; Moisture Sensitivity Level: 1; Package Shape: Rectangular; JESD-30 Code: R-PDSO-G5; Package Style: SMALL OUTLINE, LOW PROFILE, SHRINK PITCHMeter; Surface Mount: Yes; Operating Temperature, TJ-Min: -40°C; Width: 1.6mm; Source: MIC5219-3.3YM5.SchLib; Output Voltage1-Nom: 3.3V; RoHS Compliant: No; JESD-609 Code: e0; Terminal Finish: Tin; Component Type: Standard; Terminal Position: DUAL; Height - Seated (Max): 1.45mm; Length: 2.9mm; Case/Package: LSSOP; Pin Count: 4; Pins: 5; Terminal Form: Gull Wing; Design Item ID: Component_1; Reach SVHC Compliant: No; Adjustability: FIXED; Number of Outputs: 1; Peak Reflow Temperature (Cel): 240°C; Terminal Pitch: 0.95mm
C16 C19 = CMP-001-00001-6: as C2 on sheet ESP32; Max Operating Temperature: 125°C; Min Operating Temperature: -55°C; Case/Package: 0402; Mounting Technology: SM; Pins: 2; Tolerance: 5%; RoHS Compliant: True
C17 C18 = CMP-13271-000286-1: as C4 on sheet ESP32; Case Code (Imperial): 0402; Tolerance: 20%; Width: 0.02inch; Packaging: Tape and Reel; Case/Package: 0402; Min Operating Temperature: -55°C; Max Operating Temperature: 85°C; Voltage Rating: 6.3V; Capacitance: 22uF; Thickness: 0.022inch; Mount: Surface Mount; Length: 0.039inch; Case Code (Metric): 1005
C20 = CMP-001-00008-6: as C1 on sheet ESP32; Max Operating Temperature: 85°C; Mounting Technology: SM; Tolerance: 10%; Case/Package: 0402; RoHS Compliant: True; Min Operating Temperature: -55°C; Pins: 2
C21 C22 = CMP-2008-04549-2: Chip Multilayer Ceramic Capacitors for General Purpose, 0402, 4.7uF, X5R, 15%, 20%, 6.3V; Height: 0.5mm; Weight: 0.000212oz; Length: 1mm; Case Code (Metric): 1005; Packaging: Tape and Reel; Termination: SMD/SMT; Dielectric: X5R; Depth: 0.5mm; Case Code (Imperial): 0402; Min Operating Temperature: -55°C; Case/Package: 0402; Voltage: 6.3V; Width: 0.02inch; Capacitance: 4.7uF; Lead Free: Lead Free; Thickness: 0.022inch; Contact Plating: Tin; REACH SVHC: No SVHC; Package Quantity: 10000; Tolerance: 20%; Voltage Rating (DC): 6.3V; Voltage Rating: 6.3V; Mount: Surface Mount; Max Operating Temperature: 85°C
D1 = CMP-1055-00419-1: Schottky Power Rectifier, 2-Pin SOD-123, Pb-Free, Tape and Reel; Manufacturer: On Semiconductor; Configuration: Single; IFSM Max (A): 5.5; DatasheetVersion: Rev. 4; PackageDescription: 2-Pin SOD, Body 1.6 x 2.69 mm; PackageReference: SOD-123-2-425-04; ComponentLink1URL: http://www.onsemi.com/; Packing: Tape and Reel; ComponentLink3Description: Package Specification; ComponentLink2URL: http://www.onsemi.cn/pub_link/Collateral/MBR130T1-D.PDF; PackageVersion: Rev. G, 10/2009; PartNumber: NRVB130T1G; ComponentLink3URL: http://www.onsemi.com/pub_link/Collateral/425-04.PDF; ComponentLink1Description: Manufacturer URL; RoHS: TRUE; Mounting Technology: Surface Mount; ComponentLink2Description: Datasheet
J7 = CMP-00030-00002-2: as J2 on sheet ESP32
LED2 LED3 = CMP-007-00043-3: Chip LED 0402, Yellow, 0.02 A, 3.1 to 3.7 V, -40 to 80 degC, 2-Pin SMD, RoHS, Tape and Reel; Mounting Technology: SMT; Case/Package: 0402; RoHS Compliant: Yes; Pins: 2; Colour: Yellow
R23 R26 R30 R31 R34 = CMP-009-00030-5: as R3 on sheet ESP32; Mounting Technology: SM; RoHS Compliant: True; Tolerance: 1%; Min Operating Temperature: -55°C; Max Operating Temperature: 155°C; Case/Package: 0402; Pins: 2
R24 R25 = CMP-009-00012-5: Chip Resistor, 1 KOhm, +/- 1%, 63 mW, -55 to 155 degC, 0402 (1005 Metric); Power: 63mW; Max Operating Temperature: 155°C; Min Operating Temperature: -55°C; Case/Package: 0402; Pins: 2; RoHS Compliant: True; Tolerance: 1%; Mounting Technology: SM
R27 R29 = CMP-2002-08284-1: Manufacturer: Vishay Dale; Part Number: CRCW04021K20FKED
R28 = CMP-2002-07701-1: Manufacturer: Yageo / Phycomp; Part Number: RC0402FR-0747KL
R32 R33 = CMP-2002-07464-1: Manufacturer: Yageo / Phycomp; Part Number: RC0402FR-071K5L
SW3 = CMP-011-00005-2: Tactile Switch, SPST-NO, 0.05 A, 12 V, -25 to 70 degC, 2-Pin SMD, RoHS, Tape and Reel; Manufacturer: Omron Electronic Components; Operating Force: 162gf; Voltage Rating (DC): 12V; Current Rating: 50mA; IP Rating: IP40; Throw Configuration: SPST; Max Contact Resistance: 100mohm; RoHS Compliant: True; Contact Current Rating: 50mA; Manufacturer URL: http://www.omron.com/; Packaging: TapeandReel; Max Voltage Rating (DC): 12V; Contact Material: Silver; Datasheet Version: Jan-15; Package Reference: B3U-3000P; Package Description: 2-Pin Surface Mount Device, Body 4 x 3.2 mm; Min Operating Temperature: -25°C; Package Quantity: 4000; Max Operating Temperature: 70°C; Max Current Rating: 50mA; Voltage Rating: 12V; Case/Package: B3U-3000P; Mounting Technology: SM; Datasheet URL: https://www.omron.com/ecb/products/pdf/en-b3u.pdf
U8 = CMP-009-000000-1: Standalone 1-cell 1.5-A linear charger, Power Path, 4.2-V VBAT and 5.5-V VOUT 16-VQFN -40 to 85; Component Type: Standard; Package: None; Value: *; MP: BQ24075RGTR; Availability: Unavailable; Price: None; Pin Count: 17; Design Item ID: BQ24075RGTR; Source: BQ24075RGTR.SchLib
USB-TYPE-C-1 = CMP-029-000000-1: Pin Count: 20; Design Item ID: USB-TYPE-C-020; Component Type: Standard; Source: USBConnector.SchLib

## Nets that join several sheets
GND: ESP32 (25 pins), Sensors (35 pins), Interfaces (C15.2 R22.2 U7.3), Batterie (27 pins)
VCC: ESP32 (10 pins), Sensors (17 pins), Interfaces (C15.1 SW2.1 U7.1), Batterie (SW3.1)
MUX: ESP32 (U1.22), Sensors (R14.1 U4.1 U6.1)
NetR21_2: ESP32 (U1.23), Interfaces (R21.2 R22.1)
NetR24_2: ESP32 (U1.4), Batterie (R24.2 R25.1)
NetU1_5: ESP32 (U1.5), Batterie (U8.4)
NetU1_7: ESP32 (U1.7), Interfaces (U7.4)
NetU1_17: ESP32 (U1.17), Sensors (U3.4)
NetU1_18: ESP32 (U1.18), Sensors (U3.12)
NetU1_19: ESP32 (U1.19), Sensors (U3.14)
NetU1_20: ESP32 (U1.20), Sensors (U3.13)
NetU1_21: ESP32 (U1.21), Sensors (U3.1)
SCL1: ESP32 (R3.1 U1.11), Sensors (U2.10)
SCL2: ESP32 (R6.1 U1.29), Sensors (U5.10)
SDA1: ESP32 (R7.1 U1.12), Sensors (U2.9)
SDA2: ESP32 (R9.1 U1.28), Sensors (U5.9)
T_Bat: ESP32 (U1.6), Batterie (J7.1 U8.1)